# Altium schematic sheet Sheet5.SchDoc
size A4; SheetNumber: 2; SheetTotal: 2
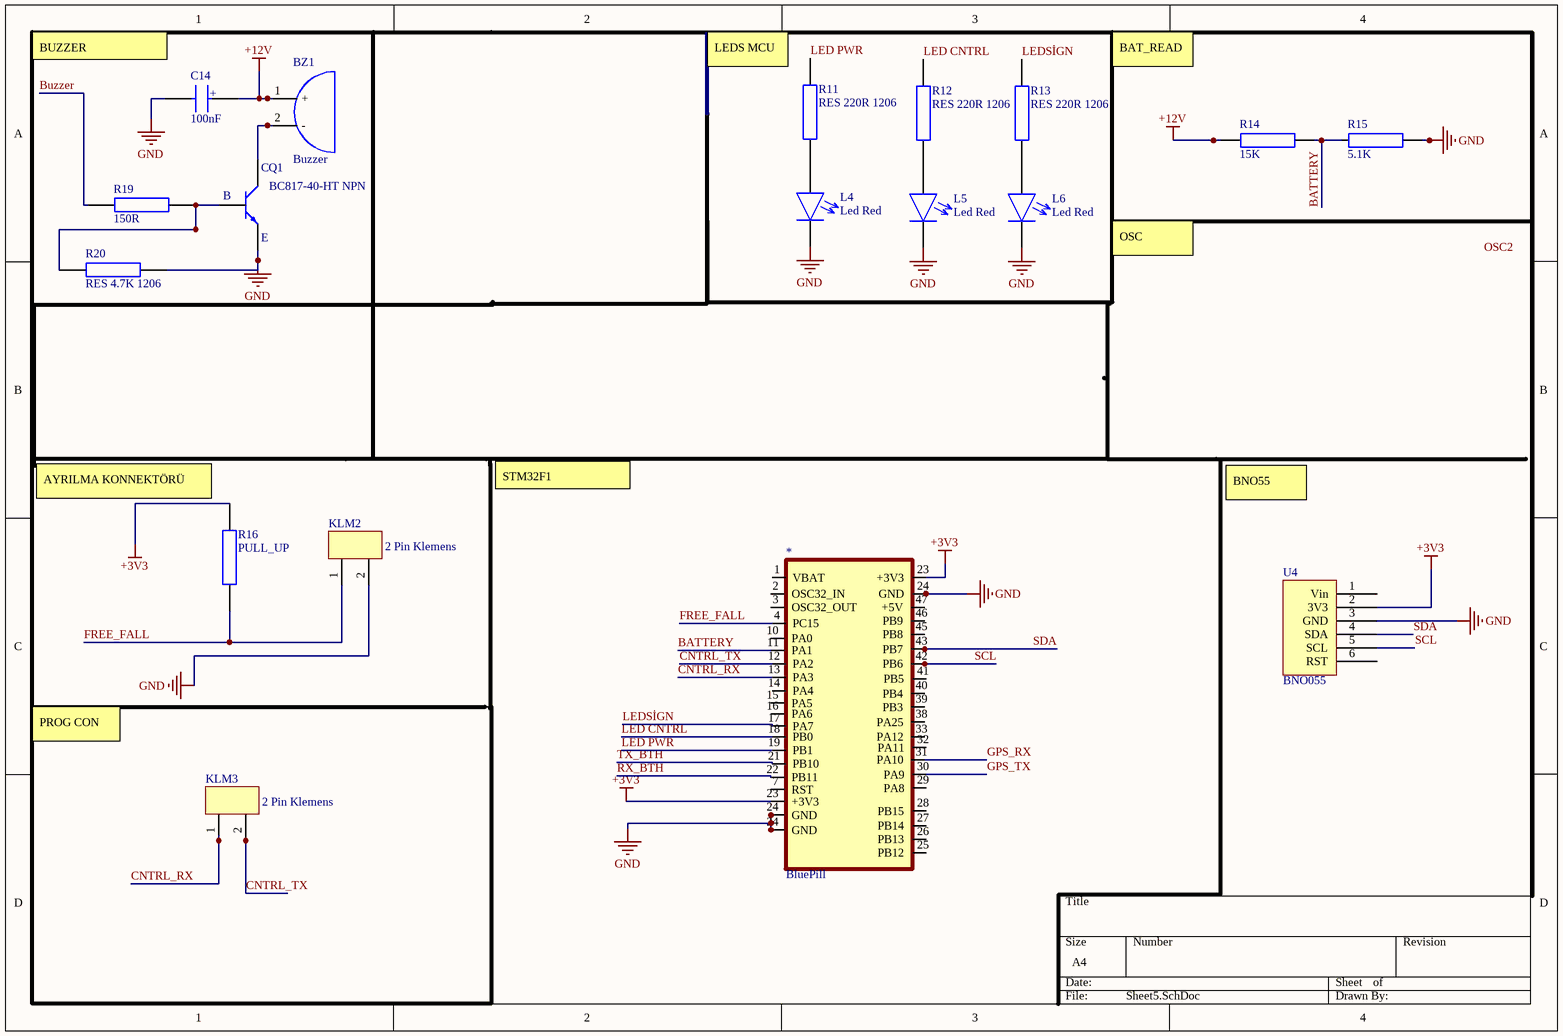
[diagram p0: Sheet5.SchDoc]

## Parts
*  BluePill  [BLUEPILL]
BZ1  Buzzer  [CMI-9605IC]
C14  100nF  [CAP_805]
KLM2  2 Pin Klemens  [5.08mm-2 pin]
KLM3  2 Pin Klemens  [5.08mm-2 pin]
L4  Led Red  [Led 1206]
L5  Led Red  [Led 1206]
L6  Led Red  [Led 1206]
Q1  BC817-40-HT NPN  [SOT-23]
R11  RES 220R 1206  [RES_1206]
R12  RES 220R 1206  [RES_1206]
R13  RES 220R 1206  [RES_1206]
R14  15K  [RES_1206]
R15  5.1K  [RES_1206]
R16  PULL_UP  [RES_1206]
R19  150R  [RES_1206]
R20  RES 4.7K 1206  [RES_1206]
U4  BNO055  [BNO055]

## Nets
+3V3: *.23(+3V3) R16.2 U4.2(3V3)
+12V: BZ1.1(+) C14.1 R14.1
GND: *.24(GND) C14.2 KLM2.2 L4.2 L5.2 L6.2 Q1.2 R15.2 R20.1 U4.3(GND)
BATTERY: *.11(PA1) R14.2 R15.1
Buzzer: R19.2
CNTRL_RX: *.13(PA3) KLM3.1
CNTRL_TX: *.12(PA2) KLM3.2
FREE_FALL: *.4(PC15) KLM2.1 R16.1
GPS_RX: *.31(PA10)
GPS_TX: *.30(PA9)
LED CNTRL: *.18(PB0) R12.2
LED PWR: *.19(PB1) R11.2
LEDSİGN: *.17(PA7) R13.2
RX_BTH: *.22(PB11)
SCL: *.42(PB6) U4.5(SCL)
SDA: *.43(PB7) U4.4(SDA)
TX_BTH: *.21(PB10)
NetBZ1_2: BZ1.2(-) Q1.3
NetL4_1: L4.1 R11.1
NetL5_1: L5.1 R12.1
NetL6_1: L6.1 R13.1
NetQ1_1: Q1.1 R19.1 R20.2

Not connected (* = marked no-connect by the designer): * 1(VBAT) 2(OSC32_IN) 3(OSC32_OUT) 7(RST) 10(PA0) 14(PA4) 15(PA5) 16(PA6) 25(PB12) 26(PB13) 27(PB14) 28(PB15) 29(PA8) 32(PA11) 33(PA12) 38(PA25) 39(PB3) 40(PB4) 41(PB5) 45(PB8) 46(PB9) 47(+5V); U4 1(Vin) 6(RST)

## Notes on the sheet
- (near C14) BUZZER
- (near R11) LEDS MCU
- BAT_READ
- OSC
- (near R16) AYRILMA KONNEKTÖRÜ
- STM32F1
- BNO55
- PROG CON
- Labels drawn without touching a wire or pin: OSC2
- (in symbol BC817-40-HT NPN) C; B; E
- (in symbol CAP 100nF 0805) +

## Library data of the parts
BZ1 = BUZZER: Designed by: Ahmet Azboy
C14 = CAP 100nF 0805: 0805 smd
KLM2 KLM3 = 2 Pin Klemens: 5.08mm 2 pin klemens
Q1 = BC817-40-HT NPN: Current: 500 mA; Voltage: 45V; Case/Package: SOT-23
R14 R15 = RES 1K 1206
R16 R19 = RES 4.7K 1206